# EAGLE design open-lux-I (EAGLE 6.5.0)
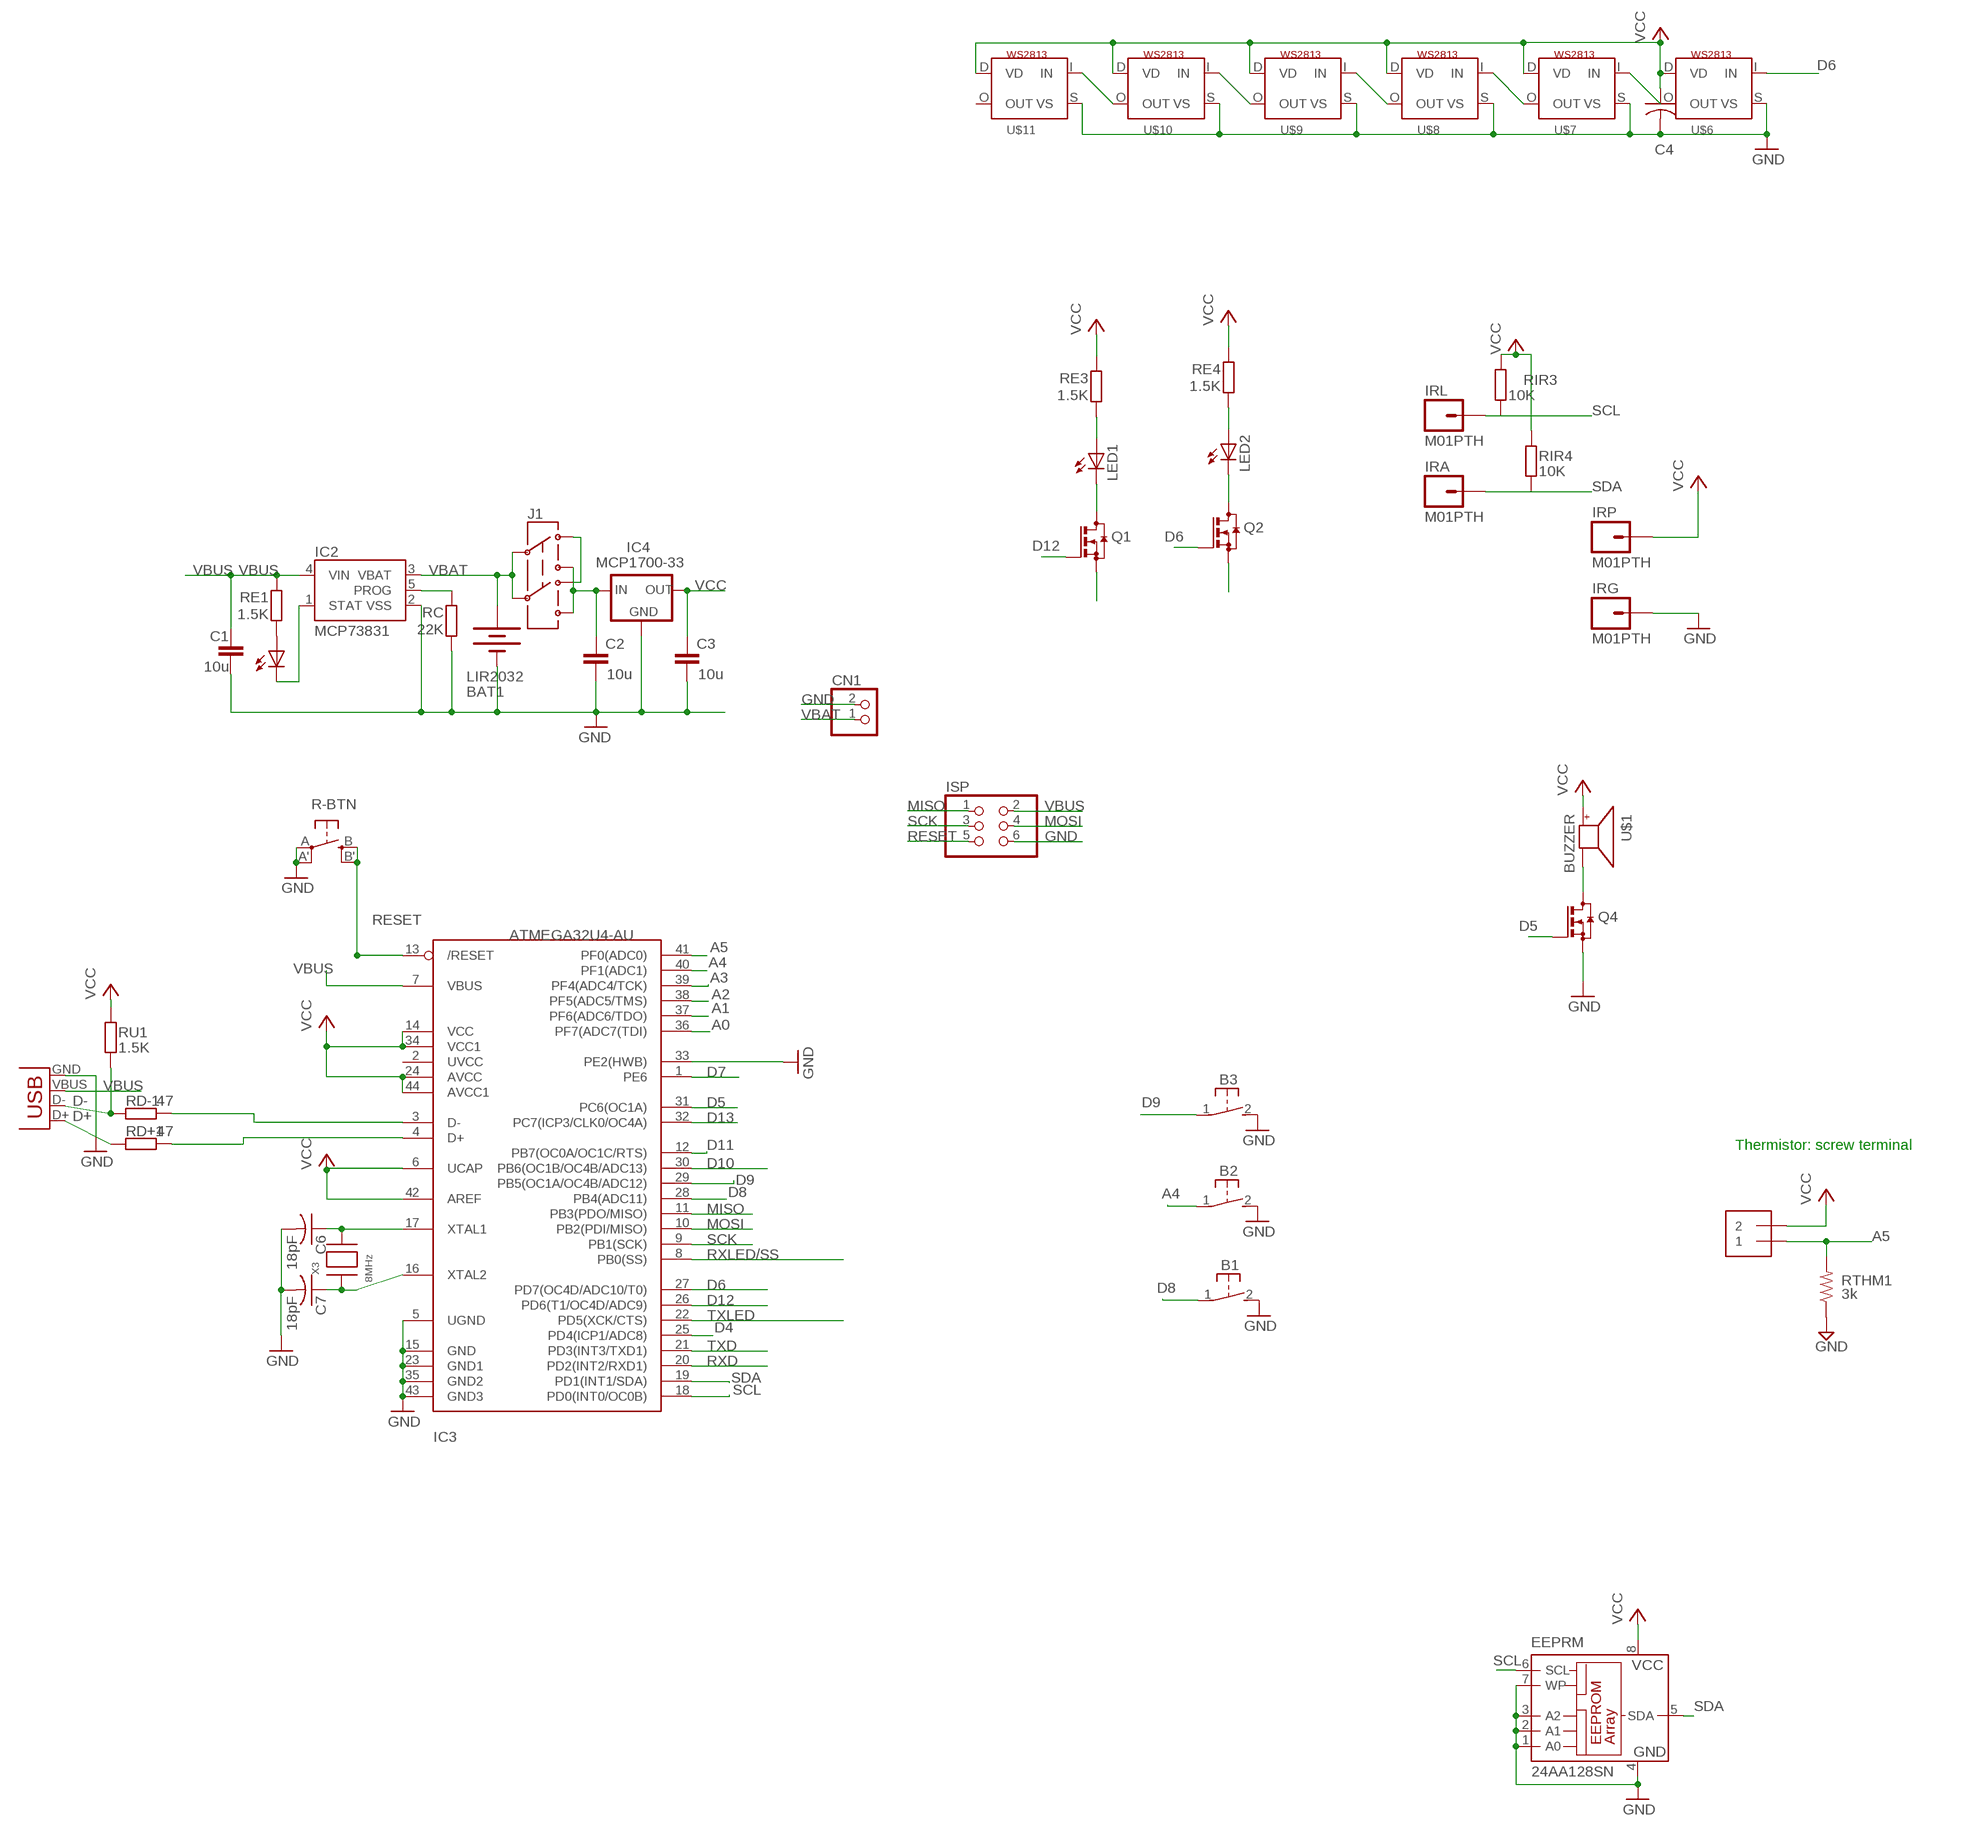
[diagram p0: schematic, sheet 1, part 1 of 2]
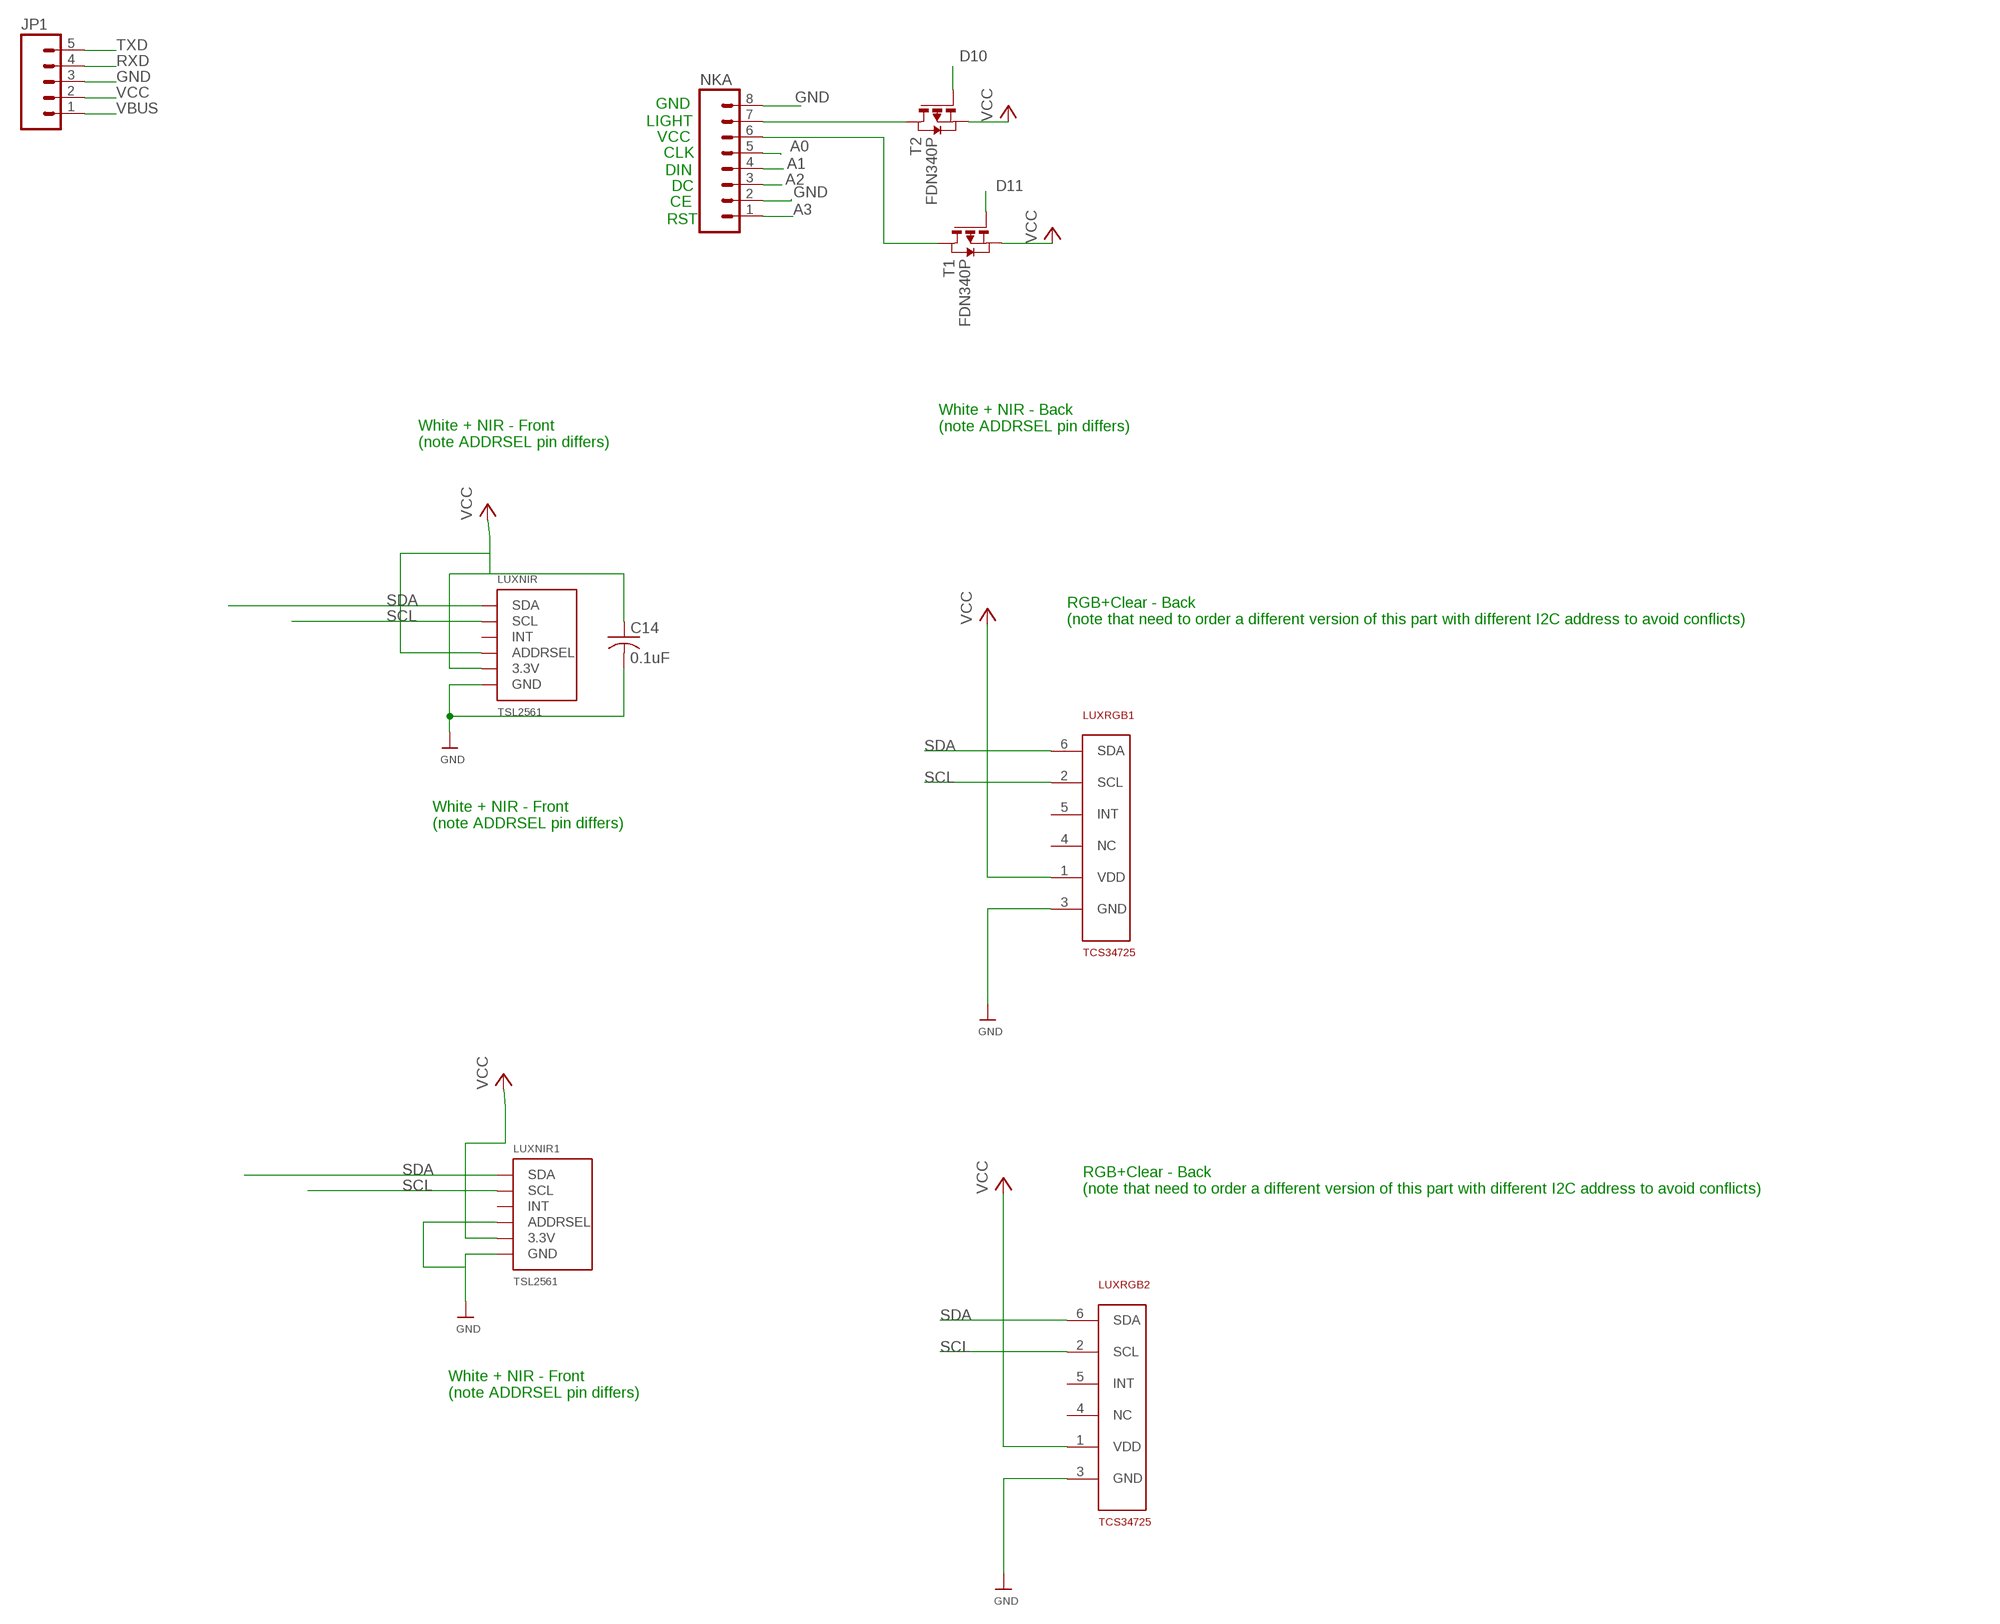
[diagram p1: schematic, sheet 1, part 2 of 2]

## Parts
B1  31-XX  [B3F-31XX]
B2  31-XX  [B3F-31XX]
B3  31-XX  [B3F-31XX]
BAT1  LIR2032  BATTERYBATTCOM_20MM_PTH_SMT  [BATTCOM_20MM_PTH_SMT]
C1  10u  C-EUC0805  [C0805]
C2  10u  C-EUC0805  [C0805]
C3  10u  C-EUC0805  [C0805]
C4  C-USC0805K  [C0805K]
C6  18pF  C-USC0805K  [C0805K]
C7  18pF  C-USC0805K  [C0805K]
C14  0.1uF  C-USC0805  [C0805]
CHARGE  0805  LEDCHIPLED_0805  [CHIPLED_0805]
CN1  JST_2PIN-SMT-RA  [JST-PH-2-SMT-RA]
EEPRM  24AA128SN  [SO-08]
IC2  MCP73831  [SOT23-5]
IC3  ATMEGA32U4-AU  [TQFP44]
IC4  MCP1700-33  MCP1700SOT233  [SOT23]
IRA  M01PTH  [1X01]
IRG  M01PTH  [1X01]
IRL  M01PTH  [1X01]
IRP  M01PTH  [1X01]
ISP  PINHD-2X3  [2X03]
J1  AYZ0202  [AYZ0202]
JP1  M05LOCK  [1X05_LOCK]
LED1  LEDCHIP-LED0603  [CHIP-LED0603]
LED2  LEDCHIP-LED0603  [CHIP-LED0603]
LUXNIR  TSL2561  [TSL2561_FN@1]
LUXNIR1  TSL2561  [TSL2561_FN@1]
LUXRGB1  TCS34725  [DFN-6]
LUXRGB2  TCS34725  [DFN-6]
NKA  M08LOCK  [1X08_LOCK]
Q1  BSS123  [SOT23]
Q2  BSS123  [SOT23]
Q4  BSS123  [SOT23]
R-BTN  EVQQ2  [EVQ-Q2]
RC  22K  R-EU_R0805  [R0805]
RD+1  47  R-EU_R0805  [R0805]
RD-1  47  R-EU_R0805  [R0805]
RE1  1.5K  R-EU_R0805  [R0805]
RE3  1.5K  R-EU_R0805  [R0805]
RE4  1.5K  R-EU_R0805  [R0805]
RIR3  10K  R-EU_R0805  [R0805]
RIR4  10K  R-EU_R0805  [R0805]
RTHM1  3k  R-US_R0805  [R0805@1]
RU1  1.5K  R-EU_R0805  [R0805]
T1  FDN340P  PMOSSOT23  [SOT-23]
T2  FDN340P  PMOSSOT23  [SOT-23]
THM1  1X2-3.5MM  [1X2-3.5MM]
U$1  BUZZER  [SMT-8585-BUZZER]
U$6  WS2813  [RGBLED5050_4]
U$7  WS2813  [RGBLED5050_4]
U$8  WS2813  [RGBLED5050_4]
U$9  WS2813  [RGBLED5050_4]
U$10  WS2813  [RGBLED5050_4]
U$11  WS2813  [RGBLED5050_4]
X2  USBSMD  [USB-MINIB]
X3  8MHz  XTALNX5032  [NX5032]

## Nets
A0: IC3.36(PF7(ADC7(TDI)) NKA.5
A1: IC3.37(PF6(ADC6/TDO)) NKA.4
A2: IC3.38(PF5(ADC5/TMS)) NKA.3
A3: IC3.39(PF4(ADC4/TCK)) NKA.1
A4: B2.1(P) IC3.40(PF1(ADC1))
A5: IC3.41(PF0(ADC0)) RTHM1.2 THM1.1
D4: IC3.25(PD4(ICP1/ADC8))
D5: IC3.31(PC6(OC1A)) Q4.1(G)
D6: IC3.27(PD7(OC4D/ADC10/T0)) Q2.1(G) U$6.I(IN)
D7: IC3.1(PE6)
D8: B1.1(P) IC3.28(PB4(ADC11))
D9: B3.1(P) IC3.29(PB5(OC1A/OC4B/ADC12))
D10: IC3.30(PB6(OC1B/OC4B/ADC13)) T2.3(G)
D11: IC3.12(PB7(OC0A/OC1C/RTS)) T1.3(G)
D12: IC3.26(PD6(T1/OC4D/ADC9)) Q1.1(G)
D13: IC3.32(PC7(ICP3/CLK0/OC4A))
D+: RD+1.1 X2.D+
D-: RD-1.1 RU1.1 X2.D-
GND: B1.2(S) B2.2(S) B3.2(S) BAT1.P$1(-) C1.2 C2.2 C3.2 C4.2 C6.2 C7.2 C14.2 CN1.2 EEPRM.1(A0) EEPRM.2(A1) EEPRM.3(A2) EEPRM.4(GND) EEPRM.7(WP) IC2.2(VSS) IC3.5(UGND) IC3.15(GND) IC3.23(GND1) IC3.33(PE2(HWB)) IC3.35(GND2) IC3.43(GND3) IC4.1(GND) IRG.1 ISP.6 JP1.3 LUXNIR1.ADR(ADDRSEL) LUXNIR1.VSS(GND) LUXNIR.VSS(GND) LUXRGB1.3(GND) LUXRGB2.3(GND) NKA.2 NKA.8 Q4.2(S) R-BTN.A'(P1) R-BTN.A(P) RC.1 RTHM1.1 U$6.S(VS) U$7.S(VS) U$8.S(VS) U$9.S(VS) U$10.S(VS) U$11.S(VS) X2.GND
GND1: Q1.2(S)
GND2: Q2.2(S)
MISO: IC3.11(PB3(PDO/MISO)) ISP.1
MOSI: IC3.10(PB2(PDI/MISO)) ISP.4
N$1: J1.3 J1.6
N$2: C7.1 IC3.16(XTAL2) X3.P$1
N$3: C6.1 IC3.17(XTAL1) X3.P$2
N$4: NKA.7 T2.1(D)
N$5: CHARGE.C IC2.1(STAT)
N$6: IC2.5(PROG) RC.2
N$7: Q4.3(D) U$1.-
N$8: NKA.6 T1.1(D)
N$9: LED1.C Q1.3(D)
N$10: CHARGE.A RE1.1
N$11: LED1.A RE3.1
N$12: LED2.C Q2.3(D)
N$13: LED2.A RE4.1
N$21: IC3.4(D+) RD+1.2
N$22: IC3.3(D-) RD-1.2
N$23: U$6.O(OUT) U$7.I(IN)
N$24: U$7.O(OUT) U$8.I(IN)
N$25: U$8.O(OUT) U$9.I(IN)
N$26: U$9.O(OUT) U$10.I(IN)
N$28: U$10.O(OUT) U$11.I(IN)
RESET: IC3.13(/RESET) ISP.5 R-BTN.B'(S1) R-BTN.B(S)
RXD: IC3.20(PD2(INT2/RXD1)) JP1.4
RXLED/SS: IC3.8(PB0(SS))
SCK: IC3.9(PB1(SCK)) ISP.3
SCL: EEPRM.6(SCL) IC3.18(PD0(INT0/OC0B)) IRL.1 LUXNIR1.CLK(SCL) LUXNIR.CLK(SCL) LUXRGB1.2(SCL) LUXRGB2.2(SCL) RIR3.1
SDA: EEPRM.5(SDA) IC3.19(PD1(INT1/SDA)) IRA.1 LUXNIR1.DATA(SDA) LUXNIR.DATA(SDA) LUXRGB1.6(SDA) LUXRGB2.6(SDA) RIR4.1
TXD: IC3.21(PD3(INT3/TXD1)) JP1.5
TXLED: IC3.22(PD5(XCK/CTS))
VBAT: BAT1.P$2(+) CN1.1 IC2.3(VBAT) J1.2 J1.5
VBUS: C1.1 IC2.4(VIN) IC3.7(VBUS) ISP.2 JP1.1 RE1.2 X2.VBUS
VCC: C3.1 C4.1 C14.1 EEPRM.8(VCC) IC3.6(UCAP) IC3.14(VCC) IC3.24(AVCC) IC3.34(VCC1) IC3.42(AREF) IC3.44(AVCC1) IC4.2(OUT) IRP.1 JP1.2 LUXNIR1.VDD(3.3V) LUXNIR.ADR(ADDRSEL) LUXNIR.VDD(3.3V) LUXRGB1.1(VDD) LUXRGB2.1(VDD) RE3.2 RE4.2 RIR3.2 RIR4.2 RU1.2 T1.2(S) T2.2(S) THM1.2 U$1.+ U$6.D(VD) U$7.D(VD) U$8.D(VD) U$9.D(VD) U$10.D(VD) U$11.D(VD)
VDD: C2.1 IC4.3(IN) J1.1 J1.4
Unconnected: IC3.2(UVCC) LUXNIR1.INT LUXNIR.INT LUXRGB1.4(NC) LUXRGB1.5(INT) LUXRGB2.4(NC) LUXRGB2.5(INT) U$11.O(OUT)

## Notes on the sheet
- GND
- LIGHT
- VCC
- CLK
- DIN
- DC
- CE
- RST
- White + NIR - Back
  (note ADDRSEL pin differs)
- White + NIR - Front
  (note ADDRSEL pin differs)
- RGB+Clear - Back 
  (note that need to order a different version of this part with different I2C address to avoid conflicts)
- White + NIR - Front
  (note ADDRSEL pin differs)
- Thermistor: screw terminal
- RGB+Clear - Back 
  (note that need to order a different version of this part with different I2C address to avoid conflicts)
- White + NIR - Front
  (note ADDRSEL pin differs)

## Library data of the parts
B1-B3 = adafruit:31-XX: OMRON SWITCH Now with beefier pads!
BAT1 = SparkFunNew:BATTERY: Battery Holders Various common sizes : AA, AAA, 20mm coin cell and 12mm coin cell.
C1-C3 = resistor:C-EU: CAPACITOR, European symbol
C4 = adafruit2013:C-US: CAPACITOR, American symbol
C6 C7 C14 = adafruit:C-US: CAPACITOR, American symbol
CHARGE = led:LED: LED
CN1 = adafruit:JST_2PIN: JST 2-Pin Connectors of various flavors SMT-RA (S2B-PH-SM4) 4UConnector #17311 SMT (B2B-PH-SM4) THM-RA (S2B-PH) THM (B2B-PH)
EEPRM = microchip:24*: Serial EEPROM I2C; MF: MICROCHIP; MPN: 24AA128-I/SN; OC_FARNELL: unknown; OC_NEWARK: 92C6842
IC2 = SparkFunNew:MCP73831: Microchip's MCP73831 Miniature single cell, fully integrated Li-Ion, Li-polymer charge management controller http://ww1.microchip.com/downloads/en/DeviceDoc/21984a.pdf
IC3 = adaprog:ATMEGA32U4
IC4 = adafruit:MCP1700: VOLTAGE REGULATOR
IRA IRG IRL IRP = SparkFun-Connectors:M01: Header 1 Standard 1-pin 0.1" header. Use with straight break away headers (SKU : PRT-00116), right angle break away headers (PRT-00553), swiss pins (PRT-00743), machine pins (PRT-00117), and female headers (PRT-00115).
ISP = pinhead:PINHD-2X3: PIN HEADER
J1 = SparkFunNew:AYZ0202: SPDT Slide Switch Simple SMD single-pull double-throw slide switch. Good for less than 350mA power switch, switching UARTs between devices, etc. Spark Fun Electronics SKU : COM-00597
JP1 = SparkFun-Connectors:M05: Header 5 Standard 5-pin 0.1" header. Use with straight break away headers (SKU : PRT-00116), right angle break away headers (PRT-00553), swiss pins (PRT-00743), machine pins (PRT-00117), and female headers (PRT-00115). Molex polarized connector foot print use with SKU : PRT-08230 with associated crimp pins and housings.
LED1 LED2 = adafruit:LED: LED
LUXNIR LUXNIR1 = microbuilder:TSL2561: TSL2561 Light-To-Digital Sensor Mouser Part Numbers: CS (obsolete): 856-TSL2561CS DFN (cheapest): 856-TSL2561FN
LUXRGB1 LUXRGB2 = dwbLibrary:TCS34725
NKA = SparkFun-Connectors:M08: Header 8 Standard 8-pin 0.1" header. Use with straight break away headers (SKU : PRT-00116), right angle break away headers (PRT-00553), swiss pins (PRT-00743), machine pins (PRT-00117), and female headers (PRT-00115).
Q1 Q2 Q4 = transistor-small-signal:BSS123: N-CHANNEL MOS FET
R-BTN = adafruit:EVQQ2: SMT 6mm switch, EVQQ2 series http://www.ladyada.net/library/eagle
RC RD+1 RD-1 RE1 RE3 RE4 RIR3 RIR4 RU1 = rcl:R-EU_: RESISTOR, European symbol
RTHM1 = rcl:R-US_: RESISTOR, American symbol
T1 T2 = zetex:PMOSSOT23: MOS FET
THM1 = adafruit:1X2: 3.5mm Terminal block http://www.ladyada.net/library/pcb/eaglelibrary.html
U$1 = adafruit:BUZZER
U$6-U$11 = adafruit:WS2813
X2 = SparkFun:USB: USB Connectors USB-B-PTH is fully proven SKU : PRT-00139 USB-miniB is fully proven SKU : PRT-00587 USB-A-PCB is untested. USB-A-H is throughly reviewed, but untested. Spark Fun Electronics SKU : PRT-00437 USB-B-SMT is throughly reviewed, but untested. Needs silkscreen touching up. USB-A-S has not been used/tested USB-MB-H has not been used/tested
X3 = adaprog:XTAL

## Net classes
0 default: width 0.254 mm, clearance 0.254 mm
1 power: width 0.254 mm, clearance 0.203 mm

## Board
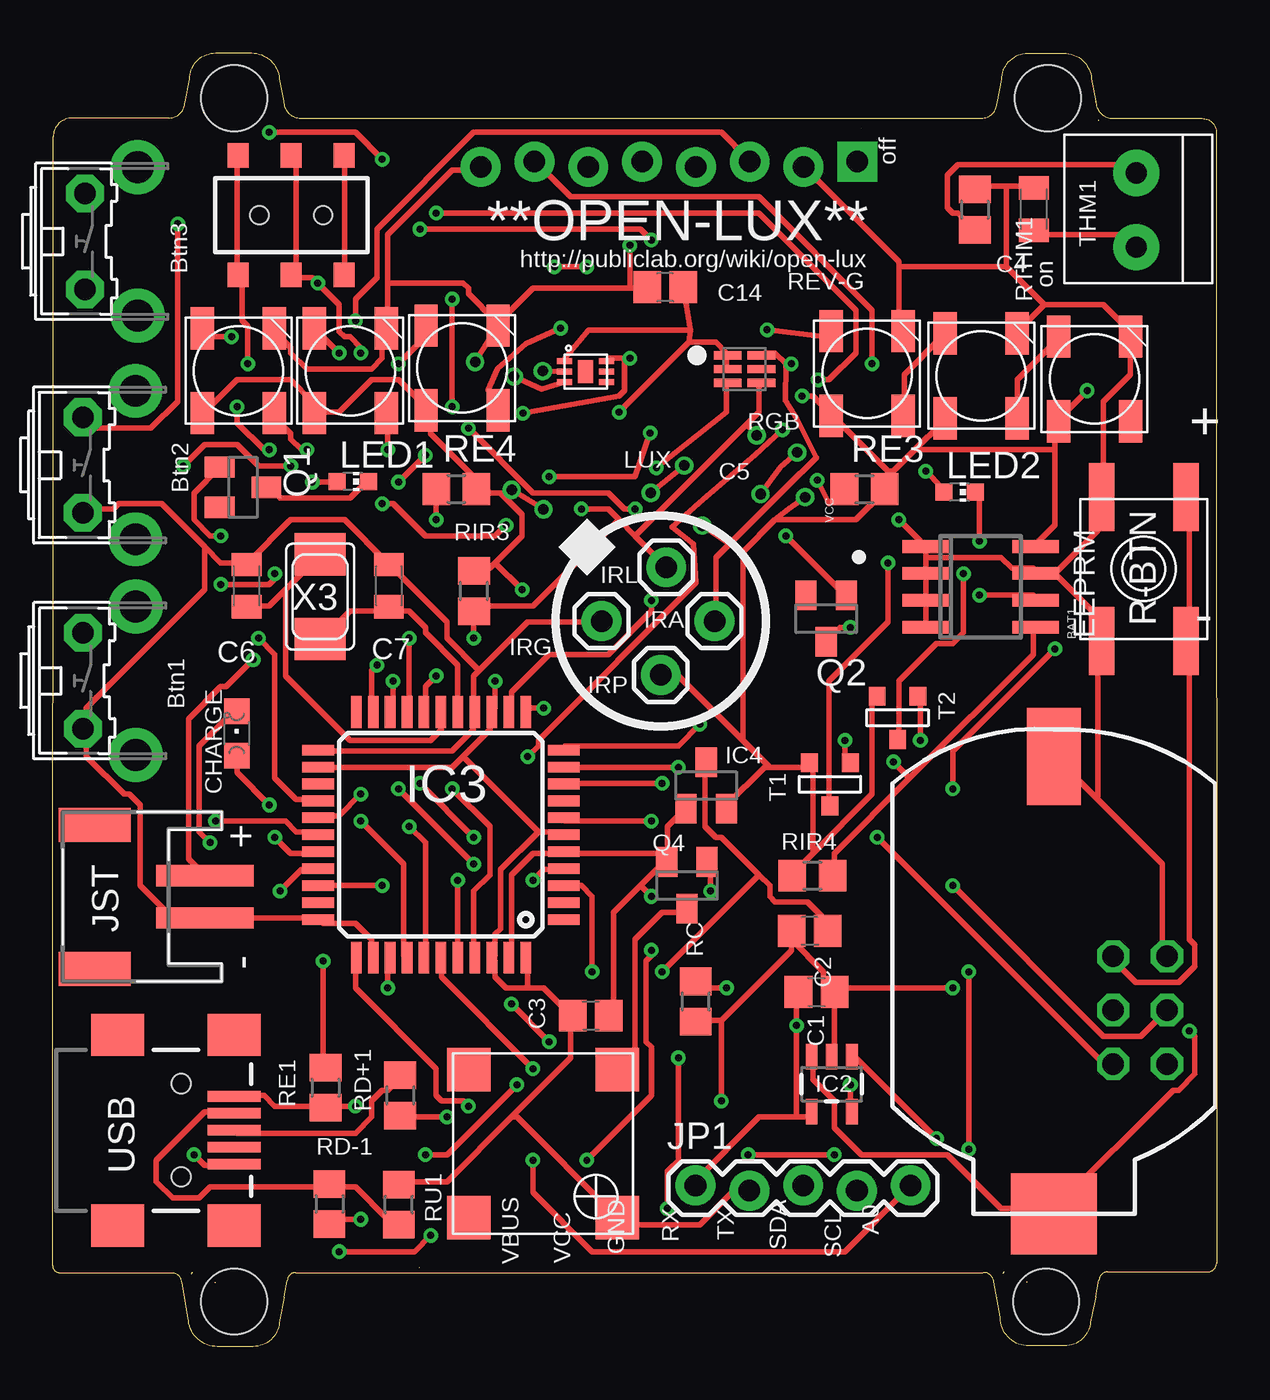
[diagram p2: board, top side]
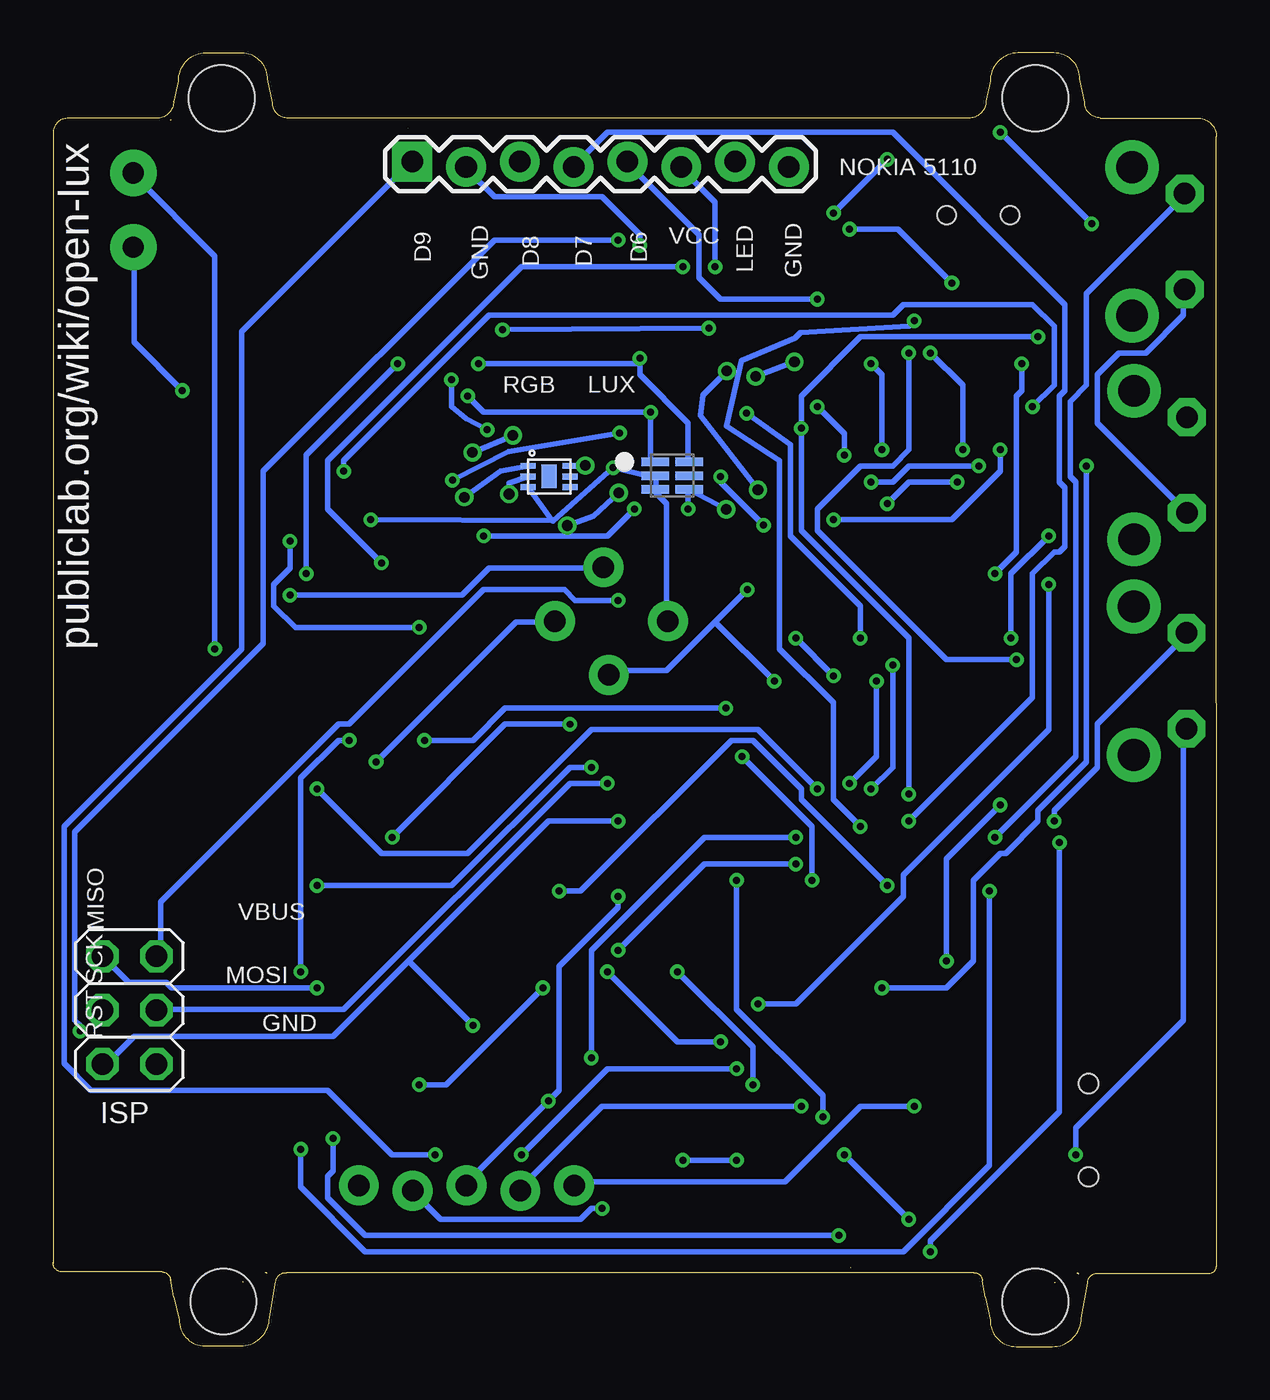
[diagram p3: board, bottom side, seen from below]

Size 54.93 x 61.06 mm. Coordinates in mm from the lower left corner, seen from the top.
Outline: 54.92,57.31 54.93,3.93
Outline: 7.63,3.03 arc-90 7.65,3.01
Outline: 17.28,3.73 arc-90 17.29,3.72
Outline: 38.17,57.5 arc-90 38.16,57.51
Outline: 49.35,57.89 arc90 49.37,57.91
Outline: 43.89,3.49 11.45,3.49 arc90 11.06,3.1
Outline: 43.84,57.98 11.7,57.98 arc-90 10.89,58.79 10.89,58.78 10.69,59.73 arc90 9.38,61.06 7.68,61.06 arc90 6.45,59.82 6.23,58.73 arc-90 5.49,57.99 0.9,57.99 arc90 0.01,57.1 0.01,56.91 0,3.82 arc90 0.36,3.46 5.59,3.46 arc-90 6.09,3.02 6.39,1.34 arc90 7.76,0 9.46,0 arc90 10.69,1.24 10.91,2.33 11.06,3.11
Outline: 43.83,57.98 arc90 44.57,58.72 44.79,59.81 arc-90 46.02,61.05 47.72,61.05 arc-90 49.03,59.72 49.23,58.77 49.23,58.78 arc90 50.04,57.97 54.26,57.97 arc-90 54.92,57.31
Outline: 6.25,2.28 6.25,2.27
Outline: 6.59,3.48 arc90 6.53,3.42
Outline: 45.95,3.06 arc-90 45.97,3.04
Outline: 44.57,2.31 44.57,2.3
Outline: 49.38,3.14 49.23,2.36 48.98,1.27 arc-90 47.75,0.03 46.08,0.03 arc-90 44.71,1.37 44.41,3.05 arc90 43.91,3.49
Outline: 49.38,3.13 arc-90 49.77,3.52 54.49,3.52 arc90 54.93,3.96
Outline: 44.91,3.51 arc90 44.85,3.45
Copper layers (1*16): Top 0.0356mm / dielectric 1.5011mm / Bottom 0.0356mm
Design rules "LaenPCBOrder": minimum track width 6mil, minimum drill 13mil, track to track 6mil, track to pad 6mil, pad to pad 6mil, via to via 6mil, smd to smd 6mil, copper to edge 15mil, drill to drill 6mil, minimum pad ring 7mil, minimum via ring 7mil, stop-mask expansion 3mil, vias tented up to drill 0mil, thermal gap 10mil
Holes 3.1 mm at 8.56,58.92 46.96,58.92 8.56,2.12 46.88,2.12

### Footprints (pad centres in the part's own frame; a part is rotated, then mirrored left to right if it is on the bottom)
B3F-31XX = drill 1.016 pad 1.778 octagon: 1 -2.261,-1.245; 2 2.261,-1.245 | drill 1.499 pad 2.54: 3 -3.505,1.245; 4 3.505,1.245
BATTCOM_20MM_PTH_SMT = smd 4.572 x 2.54: P$1 0,0 | smd 3.81 x 4.064: P$2 21.59,0
C0805 = smd 1.3 x 1.5: 1 -0.85,0; 2 0.85,0
C0805K = smd 1.1 x 1.4: 1 -1,0; 2 1,0
CHIPLED_0805 = smd 1.2 x 1.2: A 0,-1.05; C 0,1.05
JST-PH-2-SMT-RA = smd 1 x 4.6: 1 1,-3.7; 2 -1,-3.7 | smd 1.6 x 3.4: NC1 -3.4,1.5; NC2 3.4,1.5
SO-08 = smd 0.6 x 2.2: 1 -1.905,-2.6; 2 -0.635,-2.6; 3 0.635,-2.6; 4 1.905,-2.6; 5 1.905,2.6; 6 0.635,2.6; 7 -0.635,2.6; 8 -1.905,2.6
SOT23-5 = smd 0.55 x 1.2: 1 -0.95,-1.3; 2 0,-1.3; 3 0.95,-1.3; 4 0.95,1.3; 5 -0.95,1.3
TQFP44 = smd 1.5 x 0.5: 1 -5.8,4; 2 -5.8,3.2; 3 -5.8,2.4; 4 -5.8,1.6; 5 -5.8,0.8; 6 -5.8,0; 7 -5.8,-0.8; 8 -5.8,-1.6; 9 -5.8,-2.4; 10 -5.8,-3.2; 11 -5.8,-4; 23 5.8,-4; 24 5.8,-3.2; 25 5.8,-2.4; 26 5.8,-1.6; 27 5.8,-0.8; 28 5.8,0; 29 5.8,0.8; 30 5.8,1.6; 31 5.8,2.4; 32 5.8,3.2; 33 5.8,4 | smd 0.5 x 1.5: 12 -4,-5.8; 13 -3.2,-5.8; 14 -2.4,-5.8; 15 -1.6,-5.8; 16 -0.8,-5.8; 17 0,-5.8; 18 0.8,-5.8; 19 1.6,-5.8; 20 2.4,-5.8; 21 3.2,-5.8; 22 4,-5.8; 34 4,5.8; 35 3.2,5.8; 36 2.4,5.8; 37 1.6,5.8; 38 0.8,5.8; 39 0,5.8; 40 -0.8,5.8; 41 -1.6,5.8; 42 -2.4,5.8; 43 -3.2,5.8; 44 -4,5.8
SOT23 = smd 1 x 1.4: 1 -0.95,-1.1; 2 0.95,-1.1; 3 0,1.1
1X01 = drill 1.016 pad 1.88: 1 0,0
2X03 = drill 1.016 octagon: 1 -2.54,-1.27; 2 -2.54,1.27; 3 0,-1.27; 4 0,1.27; 5 2.54,-1.27; 6 2.54,1.27
AYZ0202 = smd 1 x 1.15: 1 -2.5,2.825; 2 0,2.825; 3 2.5,2.825; 4 -2.5,-2.825; 5 0,-2.825; 6 2.5,-2.825 | hole 0.85: 1.5,0; -1.5,0
1X05_LOCK = drill 1.016 pad 1.88: 1 0,0.127; 2 2.54,-0.127; 3 5.08,0.127; 4 7.62,-0.127; 5 10.16,0.127
CHIP-LED0603 = smd 0.8 x 0.8: A 0,-0.75; C 0,0.75
TSL2561_FN@1 = smd 1.3 x 0.4: ADR -0.8,0; CLK 0.8,-0.65; DATA 0.8,0.65; INT 0.8,0; VDD -0.8,0.65; VSS -0.8,-0.65
DFN-6 = smd 0.28 x 0.7: 1 -0.5,-0.988; 2 0,-0.988; 3 0.5,-0.988; 4 0.5,0.988; 5 0,0.988; 6 -0.5,0.988 | smd 1.1 x 0.7: P$1 0,0
1X08_LOCK = drill 1.016 pad 1.88 square: 1 0,0.127 | drill 1.016 pad 1.88: 2 2.54,-0.127; 3 5.08,0.127; 4 7.62,-0.127; 5 10.16,0.127; 6 12.7,-0.127; 7 15.24,0.127; 8 17.78,-0.127
EVQ-Q2 = smd 3.2 x 1.2: A -3.4,-2; A' 3.4,-2; B -3.4,2; B' 3.4,2
R0805 = smd 1.3 x 1.5: 1 -0.95,0; 2 0.95,0
R0805@1 = smd 1.3 x 1.5: 1 -0.95,0; 2 0.95,0
SOT-23 = smd 0.787 x 0.889: 1 0.025,-1.016; 2 -0.94,1.016; 3 0.991,1.016
1X2-3.5MM = drill 1 pad 2.184: 1 1.8,0; 2 -1.7,0
SMT-8585-BUZZER = smd 2.05 x 2.05: + -3.5,-3.5; - 3.5,-3.5; NC1 -3.5,3.5; NC2 3.5,3.5
RGBLED5050_4 = smd 2 x 1.1: D -2,1.7; I 2,1.7; O -2,-1.7; S 2,-1.7
USB-MINIB = smd 2.5 x 0.5: D+ 2.5,0; D- 2.5,0.8; GND 2.5,-1.6; ID 2.5,-0.8; VBUS 2.5,1.6 | smd 2.5 x 2: GND@1 -3,-4.5; GND@2 -3,4.5; GND@3 2.5,4.5; GND@4 2.5,-4.5 | hole 0.9: 0,2.2; 0,-2.2
NX5032 = smd 2 x 2.4: P$1 2,0; P$2 -2,0

### Placement (x,y rotation side)
B1  2.66,31.43 270 top
B2  2.65,41.61 270 top
B3  2.75,52.17 270 top
BAT1  47.25,27.85 270 top
C1  36.04,16.74 0 top
C2  35.73,19.62 180 top
C3  25.38,15.62 0 top
C4  46.3,53.68 90 top
C6  9.14,35.91 90 top
C7  15.86,35.91 90 top
C14  28.9,50 180 top
CHARGE  8.68,28.94 0 top
CN1  3.47,21.22 90 top
EEPRM  43.79,35.86 270 top
IC2  36.76,12.38 180 top
IC3  18.32,24.15 180 top
IC4  30.84,26.48 0 top
IRA  31.23,34.24 0 top
IRG  25.9,34.24 0 top
IRL  28.95,36.78 0 top
IRP  28.69,31.7 0 top
ISP  51.32,15.88 90 bottom
J1  11.25,53.4 0 top
JP1  30.33,7.48 0 top
LED1  14.16,40.83 270 top
LED2  42.8,40.33 270 top
LUXNIR  32.64,46.14 0 top
LUXNIR1  25.7,41.11 0 bottom
LUXRGB1  25.14,46.02 270 top
LUXRGB2  31.51,41.07 270 bottom
NKA  37.97,55.81 0 bottom
Q1  8.97,40.56 270 top
Q2  36.5,34.36 180 top
Q4  29.93,21.77 180 top
R-BTN  51.49,36.7 270 top
RC  30.34,16.29 90 top
RD+1  16.39,11.85 270 top
RD-1  13.05,6.72 270 top
RE1  12.87,12.22 270 top
RE3  38.31,40.47 0 top
RE4  19.04,40.48 0 top
RIR3  19.88,35.66 90 top
RIR4  35.85,22.22 180 top
RTHM1  43.52,53.66 270 top
RU1  16.32,6.7 90 top
T1  36.65,26.54 0 top
T2  39.84,29.68 0 top
THM1  51.14,53.6 90 top
U$1  23.14,9.58 90 top
U$6  8.76,46.06 90 top
U$7  14.03,46.06 90 top
U$8  19.31,46.19 90 top
U$9  38.43,45.93 90 top
U$10  43.82,45.82 90 top
U$11  49.16,45.67 90 top
X2  6.05,10.21 0 top
X3  12.61,35.39 270 top

### Tracks (layer width: path | path; a pad name or v marks a point on that pad's centre or on a via)
A0  (via drill 0.33)
  Top 0.254: v15.8,16.93 15.8,18.2 IC3.36 | v6.15,41.57 7.16,42.58 8.69,42.58 9.7,41.57 v11.23,41.57 | v17.58,42.07 v16.31,40.8 | v18.85,49.44 v18.85,44.36
  Bottom 0.254: v15.8,16.93 12.75,16.93 11.48,18.2 11.48,22.01 10.21,23.28 9.96,23.28 8.43,24.8 8.43,25.31 6.15,27.6 v6.15,41.57 | v11.23,41.57 14.53,41.57 15.29,40.8 v16.31,40.8 | v17.58,42.07 17.58,43.09 v18.85,44.36 | v18.85,49.44 23.42,49.44 24.44,50.46 24.44,52.49 27.74,55.79 NKA.5
A1  (via drill 0.33)
  Top 0.254: v14.53,24.8 16.56,22.77 16.56,18.45 IC3.37
  Bottom 0.254: v14.53,24.8 8.69,30.64 8.69,36.49 7.67,37.5 7.42,37.5 7.16,37.76 7.16,40.55 7.42,40.8 7.42,44.87 7.16,45.12 7.16,49.19 15.29,57.31 28.75,57.31 30.28,55.79 NKA.4
A2  (via drill 0.33)
  Top 0.254: v16.82,24.55 17.58,23.79 17.58,18.45 IC3.38 | v14.28,48.42 14.28,49.44 15.29,50.46 15.29,52.74 19.86,57.31 31.55,57.31 32.82,56.04 NKA.3
  Bottom 0.254: v16.82,24.55 18.09,25.82 18.09,30.39 20.63,32.93 20.63,41.82 23.14,43.44 22.42,46.54 19.9,47.61 19.64,47.86 14.53,48.17 v14.28,48.42
A3  (via drill 0.33)
  Top 0.254: v22.66,13.12 18.34,17.44 18.34,18.2 IC3.39 | v36.88,9.05 v32.82,9.05
  Bottom 0.254: v22.66,13.12 28.75,13.12 v32.82,9.05 | v36.88,9.05 38.91,9.05 41.96,12.1 53.14,12.1 54.41,13.37 54.41,24.55 46.03,32.93 46.03,47.92 38.15,55.79 NKA.1
A4  (via drill 0.33)
  Top 0.254: v19.1,22.01 19.1,18.45 IC3.40 | v22.4,27.85 22.91,28.36 22.91,28.61 30.36,36.06 30.24,37.88 29.23,38.69 30.72,40 33.13,42.09 v34.43,43.28 | v36.12,45.63 36.63,45.63 37.9,46.9 37.9,48.93 33.33,53.5 v18.09,53.5 | v15.55,56.04 14.28,57.31 v10.21,57.31 | v5.89,53 5.89,44.61 4.62,43.34 2.08,43.34 1.58,43.85 B2.1
  Bottom 0.254: v19.1,22.01 19.1,24.55 v22.4,27.85 | v34.43,43.28 35.42,43.79 36.12,44.36 v36.12,45.63 | v15.55,56.04 v18.09,53.5 | v5.89,53 v10.21,57.31
A5  (via drill 0.33)
  Top 0.254: v18.85,26.33 20.63,24.55 20.63,22.26 19.86,21.5 19.86,18.45 IC3.41 | v42.47,26.33 42.47,28.1 v47.3,32.93 | RTHM1.2 42.72,53.5 42.47,53.5 42.22,53.76 42.22,55.28 42.72,55.79 50.85,55.79 51.11,55.54 THM1.1
  Bottom 0.254: v18.85,26.33 21.64,29.12 29.52,29.12 35.36,23.28 39.42,23.28 v42.47,26.33 | v47.3,32.93 47.3,51.47 51.11,55.28 THM1.1
D5  (via drill 0.33)
  Top 0.254: v31.04,21.5 31.04,22.77 Q4.1 | IC3.31 v15.55,21.75
  Bottom 0.254: v31.04,21.5 30.02,21.5 22.91,28.61 21.9,28.61 19.61,26.33 19.61,25.82 v15.55,21.75
D6  (via drill 0.33)
  Top 0.254: v34.6,38.26 37.39,35.47 Q2.1 | v27.48,39.53 26.98,39.53 26.21,40.3 22.66,40.3 v19.61,43.34 | v8.43,47.66 7.42,47.66 7.16,47.92 U$6.I | v14.53,26.07 13.51,25.06 12.75,25.06 IC3.27
  Bottom 0.254: v34.6,38.26 28.75,38.26 v27.48,39.53 | v8.43,47.66 16.82,47.66 19.61,44.87 v19.61,43.34 19.61,38.52 14.53,33.44 v14.53,26.07
D8  (via drill 0.33)
  Top 0.254: v7.67,24.8 10.97,24.8 11.48,24.29 12.5,24.29 IC3.28
  Bottom 0.254: v7.67,24.8 7.67,25.31 5.64,27.34 5.64,29.37 1.58,33.44 B1.1
D9  (via drill 0.33)
  Top 0.254: v10.47,24.04 11.23,23.28 12.5,23.28 IC3.29
  Bottom 0.254: v10.47,24.04 6.66,27.85 6.66,40.8 6.91,41.06 6.91,44.61 6.15,45.38 6.15,49.69 1.58,54.27 B3.1
D10  (via drill 0.33)
  Top 0.254: v40.95,28.61 40.95,30.64 T2.3 | v43.23,9.31 v43.23,17.69 | v10.72,21.5 11.74,22.52 12.5,22.52 IC3.30
  Bottom 0.254: v40.95,28.61 41.45,28.61 43.23,26.83 v43.23,17.69 | v43.23,9.31 43.23,7.53 40.18,4.48 14.78,4.48 10.72,8.55 v10.72,21.5
D11  (via drill 0.33)
  Top 0.254: v37.39,28.61 37.39,27.6 T1.3 | v23.17,30.14 22.4,30.14 IC3.12
  Bottom 0.254: v37.39,28.61 35.1,28.61 33.58,30.14 v23.17,30.14
D12  (via drill 0.33)
  Top 0.254: Q1.1 6.66,40.3 6.66,39.03 7.42,38.26 v7.93,38.26 | v9.7,33.44 10.47,32.68 10.47,26.83 11.48,25.82 12.5,25.82 IC3.26
  Bottom 0.254: v7.93,38.26 9.7,36.49 v9.7,33.44
D+
  Top 0.254: RD+1.1 16.31,12.61 15.8,12.1 15.55,12.1 15.04,11.59 15.04,10.83 14.28,10.07 8.69,10.07 X2.D+
D-
  Top 0.254: RU1.1 16.31,6.01 15.8,6.01 14.28,7.53 13.26,7.53 RD-1.1 13.01,7.53 7.42,7.53 6.91,7.02 5.64,7.02 4.88,7.78 4.88,8.8 7.16,11.09 8.43,11.09 X2.D-
GND  (via drill 0.33, 0.5 pad 0.25)
  Top 0.254: IC3.35 15.04,18.45 15.04,19.21 14.28,19.98 12.75,19.98 IC3.33 12.5,20.23 7.42,20.23 CN1.2 5.64,20.23 4.12,21.75 4.12,25.56 3.61,26.07 3.35,26.07 1.58,27.85 1.58,29.12 B1.2 1.58,29.37 1.58,30.14 7.16,35.72 7.16,37.76 | v6.66,9.05 7.16,8.55 8.43,8.55 X2.GND | 7.16,37.76 7.93,36.99 8.94,36.99 C6.2 9.2,36.99 11.23,39.03 13.77,39.03 15.8,36.99 C7.2 16.05,36.74 18.59,34.2 18.59,33.44 20.12,31.91 | 7.16,37.76 5.13,39.79 3.1,39.79 2.85,39.53 1.58,39.53 B2.2 | IC3.23 12.75,28.1 18.85,28.1 19.86,29.12 19.86,29.88 IC3.15 19.86,30.14 19.86,31.66 20.12,31.91 | v28.48,41.48 31.8,44.11 31.8,45.38 LUXNIR.VSS | 20.12,31.91 22.4,34.2 25.71,34.2 IRG.1 | IC3.43 21.64,18.45 21.64,22.26 22.66,23.28 23.93,23.28 IC3.5 24.18,23.28 29.01,23.28 | 29.01,23.28 29.01,24.55 29.77,25.31 IC4.1 | 29.01,23.28 29.01,23.02 Q4.2 | 27.74,21.75 28.75,22.77 Q4.2 | 27.74,21.75 26.47,20.48 26.47,15.66 C3.2 | 29.01,23.28 Q4.2 | IC2.2 36.88,13.88 36.88,16.67 C1.2 | 31.55,15.4 30.53,15.4 RC.1 | 31.55,15.4 34.85,18.71 34.85,19.21 | 34.85,19.21 34.85,19.47 C2.2 34.85,19.21 | 34.85,19.21 36.37,17.69 36.37,17.44 36.88,16.93 C1.2 | 31.55,15.4 v31.55,11.59 | v28.25,21.25 27.74,21.75 | EEPRM.4 41.2,34.2 EEPRM.3 41.2,35.47 EEPRM.2 41.2,36.74 41.2,37.25 | 41.2,37.25 41.2,37.76 EEPRM.1 40.95,38.01 v39.93,39.03 | 47.3,36.49 46.53,36.49 EEPRM.7 | 47.3,36.49 49.33,34.45 49.33,33.44 R-BTN.A' 49.33,33.18 49.33,25.82 | 41.2,37.25 44.76,37.25 45.26,36.74 46.28,36.74 EEPRM.7 | 49.33,25.82 47.3,27.85 BAT1.P$1 | 49.33,25.82 52.38,22.77 52.38,18.45 ISP.6 | 27.23,49.95 22.66,49.95 21.13,48.42 U$8.S | 27.23,49.95 27.99,49.95 C14.2
  Top 0.254: U$6.S 10.47,47.92 11.23,47.15 11.23,46.9 11.99,46.14 15.04,46.14 15.55,46.65 15.55,47.92 U$7.S 15.8,48.17 15.8,50.2 | 15.8,50.2 15.8,52.49 18.85,55.54 20.12,55.54 NKA.8 | 15.8,50.2 19.36,50.2 19.61,49.95 19.61,49.69 20.88,48.42 U$8.S | 39.93,50.96 39.93,51.22 35.61,55.54 NKA.2 | 39.93,50.96 39.93,48.17 U$9.S | 45.01,54.77 43.74,54.77 RTHM1.1 | 45.01,54.77 46.28,54.77 C4.2 | 46.79,49.19 45.52,47.92 U$10.S | 46.79,49.19 49.58,49.19 50.85,47.92 U$11.S 50.85,45.88 49.58,44.61 49.58,40.3 R-BTN.A 49.33,40.04 49.33,38.52 47.3,36.49 | 45.01,50.96 45.01,54.77 | 46.79,49.19 45.01,50.96 | 45.01,50.96 39.93,50.96 | v27.23,51.98 27.23,49.95 | 47.3,36.49 EEPRM.7 | v42.47,16.93 37.14,16.93 C1.2 | LUXRGB1.3 23.06,45.19 v21.76,45.79 | v19.93,46.48 U$8.S
  Bottom 0.254: v6.66,9.05 6.66,10.32 1.58,15.4 1.58,29.12 B1.2 | B3.2 1.58,49.69 1.58,48.68 3.35,46.9 4.62,46.9 5.64,45.88 5.64,43.6 1.58,39.53 B2.2 | IRG.1 25.96,34.45 25.96,39.79 26.47,40.3 LUXNIR1.VSS 26.47,40.55 26.47,41.06 LUXNIR1.ADR 26.72,41.06 v28.48,41.48 31.32,38.98 31.38,38.98 | JP1.3 35.36,7.78 v31.55,11.59 31.04,12.1 31.04,17.94 28.25,20.74 v28.25,21.25 | v27.23,51.98 27.23,52.49 29.01,54.27 34.09,54.27 35.36,55.54 NKA.2 | v42.47,16.93 49.33,16.93 49.58,17.18 51.36,17.18 52.38,18.2 ISP.6 | v39.93,39.03 31.38,38.98 | LUXRGB2.3 31.38,38.98 | v21.76,45.79 v19.93,46.48
MISO  (via drill 0.33)
  Top 0.254: v30.53,29.37 29.52,28.36 24.18,28.36 IC3.11 | v38.91,24.04 49.84,13.12 ISP.1
  Bottom 0.254: v30.53,29.37 33.58,29.37 v38.91,24.04
MOSI  (via drill 0.33)
  Top 0.254: v29.52,27.34 24.18,27.34 IC3.10 | v42.47,21.75 49.58,14.64 51.36,14.64 52.38,15.66 ISP.4
  Bottom 0.254: v29.52,27.34 30.53,27.34 36.12,21.75 v42.47,21.75
N$1
  Top 0.254: J1.6 13.77,50.71 13.77,56.04 J1.3
N$2
  Top 0.254: X3.P$1 12.75,33.44 14.02,34.71 15.8,34.71 C7.1 16.05,34.71 16.82,34.71 17.58,33.95 17.58,33.69 19.1,32.17 19.1,30.14 IC3.16
N$3
  Top 0.254: 10.97,35.72 12.5,37.25 X3.P$2 | 10.97,35.72 10.21,34.96 9.2,34.96 C6.1 | 10.97,35.72 10.97,31.66 14.02,28.61 17.83,28.61 18.34,29.12 18.34,29.88 IC3.17
N$4  (via drill 0.33)
  Top 0.254: v42.98,36.49 42.98,33.69 42.47,33.18 41.71,33.18 39.93,31.41 39.93,28.87 T2.1 | v38.66,46.39 38.66,48.93 33.33,54.27 24.44,54.27 22.91,55.79 NKA.7
  Bottom 0.254: v42.98,36.49 42.98,42.07 v38.66,46.39
N$5  (via drill 0.33)
  Top 0.254: v41.71,9.82 37.9,13.63 IC2.1 | v17.83,5.24 17.07,4.48 v13.51,4.48 | v7.42,23.79 6.91,24.29 6.91,28.36 8.43,29.88 CHARGE.C
  Bottom 0.254: v41.71,9.82 41.71,8.29 41.96,8.04 41.96,7.02 40.18,5.24 v17.83,5.24 | v13.51,4.48 13.51,4.99 7.42,11.09 v7.42,23.79
N$6  (via drill 0.33)
  Top 0.254: v37.64,12.36 37.64,11.09 IC2.5 | v31.8,16.93 30.79,16.93 30.53,17.18 RC.2
  Bottom 0.254: v37.64,12.36 36.37,12.36 v31.8,16.93
N$7
  Top 0.254: Q4.3 29.77,20.48 28.75,20.48 27.48,19.21 27.48,13.88 26.72,13.12 U$1.-
N$8  (via drill 0.33)
  Top 0.254: v39.42,36.99 39.42,34.2 36.63,31.41 36.63,25.56 T1.1 | v23.67,50.96 v25.2,50.96
  Bottom 0.254: v39.42,36.99 41.96,39.53 41.96,41.82 32.82,50.96 v25.2,50.96 | v23.67,50.96 23.67,54.01 25.2,55.54 NKA.6
N$9
  Top 0.254: LED1.C 14.78,40.8 14.02,40.04 10.72,40.04 10.21,40.55 Q1.3
N$10  (via drill 0.33)
  Top 0.254: v10.21,25.56 8.69,27.09 8.69,27.85 CHARGE.A | v12.75,18.2 12.75,13.37 RE1.1
  Bottom 0.254: v10.21,25.56 12.75,23.02 v12.75,18.2
N$11  (via drill 0.33)
  Top 0.254: v12.24,40.8 13.26,40.8 LED1.A | v15.55,39.79 16.05,39.79 17.58,38.26 20.88,38.26 v21.39,38.77 | v23.42,41.06 27.48,41.06 v28.18,43.13 | v36.08,40.89 36.63,39.79 37.14,40.3 RE3.1
  Bottom 0.254: v12.24,40.8 14.53,40.8 v15.55,39.79 | v21.39,38.77 23.42,40.8 v23.42,41.06 | v28.18,43.13 33.44,42.25 v36.08,40.89
N$12  (via drill 0.33)
  Top 0.254: v43.74,38.01 43.74,40.3 LED2.C | v37.64,33.95 37.14,33.95 36.63,33.44 Q2.3
  Bottom 0.254: v43.74,38.01 43.74,36.74 44.5,35.98 44.5,34.96 43.49,33.95 v37.64,33.95
N$13  (via drill 0.33)
  Top 0.254: v41.2,41.31 41.96,40.55 LED2.A | v8.69,44.36 8.69,43.6 9.96,42.33 v10.21,42.33 | v18.09,39.03 18.09,40.3 RE4.1
  Bottom 0.254: v41.2,41.31 41.2,41.82 34.34,48.68 15.29,48.68 14.78,49.19 8.69,49.19 7.67,48.17 7.67,45.38 v8.69,44.36 | v10.21,42.33 10.21,41.31 12.5,39.03 v18.09,39.03
N$21  (via drill 0.33)
  Top 0.254: v18.59,10.83 16.56,10.83 RD+1.2 | v22.66,22.01 23.17,22.52 23.93,22.52 IC3.4
  Bottom 0.254: v18.59,10.83 18.59,11.85 22.66,15.91 v22.66,22.01
N$22  (via drill 0.33)
  Top 0.254: v14.53,6.01 13.26,6.01 RD-1.2 | v17.58,9.05 18.59,9.05 v21.9,12.36 | v25.45,17.69 25.45,21.25 24.94,21.75 IC3.3
  Bottom 0.254: v17.58,9.05 v14.53,6.01 | v21.9,12.36 21.9,14.13 v25.45,17.69
N$23  (via drill 0.33)
  Top 0.254: v11.99,42.33 11.74,42.33 11.23,42.84 11.23,43.09 10.47,43.85 U$6.O | v13.51,46.9 12.5,47.92 U$7.I
  Bottom 0.254: v11.99,42.33 11.99,45.38 v13.51,46.9
N$24  (via drill 0.33)
  Top 0.254: v15.8,42.33 15.8,43.85 U$7.O | v16.31,46.39 17.58,47.66 17.58,48.17 U$8.I
  Bottom 0.254: v15.8,42.33 15.8,45.88 v16.31,46.39
N$25  (via drill 0.33)
  Top 0.254: v23.97,48.07 22.32,47.35 20.98,46.16 20.53,45.14 21.13,44.36 U$8.O | v33.71,47.99 36.37,47.66 36.63,47.92 U$9.I
  Bottom 0.254: v33.71,47.99 v23.97,48.07
N$26
  Top 0.254: U$9.O 40.18,44.11 40.18,45.88 41.96,47.66 U$10.I
N$28
  Top 0.254: U$10.O 45.52,43.85 45.52,45.63 47.55,47.66 U$11.I
RESET  (via drill 0.33)
  Top 0.254: R-BTN.B 53.65,40.04 53.65,33.44 R-BTN.B' 53.65,33.18 53.65,19.21 53.9,18.96 53.9,17.94 53.14,17.18 51.11,17.18 50.09,18.2 ISP.5 | v28.25,35.22 28.25,34.71 26.21,32.68 23.42,32.68 21.64,30.9 21.64,30.14 IC3.13
  Bottom 0.254: v28.25,35.22 30.28,35.22 30.79,35.72 34.6,35.72 40.95,29.37 41.45,29.37 49.84,20.99 49.84,18.45 ISP.5
RXD  (via drill 0.33)
  Top 0.254: v16.05,31.41 16.05,30.14 IC3.20 | v19.86,24.04 v17.32,26.58 | v29.52,13.63 29.52,8.8 29.01,8.29 v29.01,6.51
  Bottom 0.254: v16.05,31.41 16.05,27.85 v17.32,26.58 | v19.86,24.04 24.18,24.04 29.52,18.71 v29.52,13.63 | v29.01,6.51 29.52,6.51 30.02,6.01 36.63,6.01 37.9,7.28 JP1.4
SCK  (via drill 0.33)
  Top 0.254: v28.75,26.58 24.18,26.58 IC3.9
  Bottom 0.254: v28.75,26.58 30.53,26.58 41.2,15.91 49.84,15.91 ISP.3
SCL  (via drill 0.33, 0.5 pad 0.25)
  Top 0.254: v18.09,31.66 17.58,31.15 17.58,30.14 IC3.18 | v19.86,33.44 19.86,34.71 RIR3.1 20.12,34.96 22.66,34.96 26.72,39.03 | v24.94,39.53 26.21,39.53 26.72,39.03 | 27.48,38.26 28.75,36.99 IRL.1 | 27.48,38.26 26.72,39.03 | 27.48,38.26 32.73,43.51 | 32.73,43.51 33.33,44.11 33.33,45.38 LUXNIR.CLK | v43.74,35.47 46.28,35.47 EEPRM.6 | v33.4,40.24 34.35,41.51 v35.13,42.2 | v33.22,43.01 32.73,43.51 | v23.15,39.52 v21.65,40.44 | v23.12,46.05 LUXRGB1.2
  Bottom 0.254: v19.86,33.44 v18.09,31.66 | v24.94,39.53 24.94,40.3 LUXNIR1.CLK v23.15,39.52 | v43.74,35.47 35.61,35.47 34.34,36.74 29.01,36.74 IRL.1 | LUXRGB2.2 33.41,40.76 v33.4,40.24 | v35.13,42.2 v33.22,43.01 | v21.65,40.44 24.36,43.95 24.24,44.91 v23.12,46.05
SDA  (via drill 0.33, 0.5 pad 0.25)
  Top 0.254: 40.44,26.83 46.28,32.68 46.28,33.95 EEPRM.5 | 40.44,26.83 36.88,23.28 36.88,22.26 RIR4.1 | 34.6,46.39 34.09,46.9 33.58,46.9 LUXNIR.DATA | 34.6,46.39 34.57,44.65 35.09,43.82 36.03,41.96 34.6,40.55 31.92,37.88 | 31.92,37.88 31.29,37.25 31.29,34.45 IRA.1 | 26.98,46.65 26.21,46.65 LUXRGB1.6 | v16.82,33.44 16.82,30.14 IC3.19 | v22.18,44.06 26.72,44.87 26.98,45.12 26.98,46.65 | 26.98,46.65 v27.23,46.65 | v34.85,46.39 34.6,46.39 | v39.68,27.6 40.44,26.83 | v29.8,41.59 v28.22,40.3 | v30.65,38.75 31.92,37.88
  Bottom 0.254: 27.23,46.39 27.23,45.88 24.94,43.6 24.94,41.82 LUXNIR1.DATA | v16.82,33.44 16.82,34.96 20.12,38.26 20.12,42.58 v22.18,44.06 | 27.23,46.39 v34.85,46.39 | 27.23,46.39 v27.23,46.65 | v39.68,27.6 33.07,34.2 31.29,34.2 IRA.1 | LUXRGB2.6 v29.8,41.59 | v28.22,40.3 29.41,39.19 v30.65,38.75
TXD  (via drill 0.33)
  Top 0.254: v15.29,32.17 15.04,31.91 15.04,30.14 IC3.21 | v19.86,22.77 v16.31,26.33 | v28.25,18.71 28.25,18.45 27.99,18.2 27.99,14.39 28.25,14.13 28.25,11.85 v25.2,8.8 | v22.66,8.8 22.66,7.28 25.45,4.48 37.39,4.48 40.44,7.53 JP1.5
  Bottom 0.254: v15.29,32.17 15.29,27.34 v16.31,26.33 | v19.86,22.77 24.18,22.77 v28.25,18.71 | v22.66,8.8 v25.2,8.8
VBAT  (via drill 0.33)
  Top 0.254: IC2.3 35.87,13.63 35.87,12.61 36.88,11.59 36.88,10.32 38.15,9.05 42.22,9.05 44.76,6.51 47.04,6.51 BAT1.P$2 47.3,6.51 52.88,12.1 53.14,12.1 53.9,12.86 53.9,14.64 v53.65,14.9 | J1.2 11.48,56.04 11.48,50.71 J1.5 11.48,50.46 12.24,50.46 v12.5,50.2 13.51,49.19 13.51,47.92 13.77,47.66 14.02,47.66 14.53,47.15 v14.53,46.9 | v9.45,32.42 8.18,31.15 7.93,31.15 6.4,29.63 6.4,23.02 7.16,22.26 CN1.1 | v28.25,52.23 27.74,52.74 v17.32,52.74
  Bottom 0.254: v14.53,46.9 14.53,42.33 15.29,41.57 16.82,41.57 18.85,39.53 18.85,38.52 12.75,32.42 v9.45,32.42 | v53.65,14.9 53.65,15.15 53.9,15.4 53.9,24.29 45.01,33.18 45.01,41.31 34.09,52.23 v28.25,52.23 | v17.32,52.74 15.04,52.74 v12.5,50.2
VBUS  (via drill 0.33)
  Top 0.254: X2.VBUS 8.69,11.85 9.96,11.85 10.47,11.34 12.75,11.34 RE1.2 13.01,11.34 v14.28,11.34 | 35.1,10.83 33.33,10.83 30.28,7.78 JP1.1 | 35.1,10.83 35.61,10.83 IC2.4 | 35.1,10.83 v35.1,15.15 35.1,16.67 C1.1 | v28.25,24.8 24.18,24.8 IC3.7
  Bottom 0.254: v14.28,11.34 16.82,11.34 20.37,7.78 30.28,7.78 JP1.1 | v28.25,24.8 31.55,24.8 38.15,18.2 | 38.15,18.2 41.71,14.64 51.11,14.64 52.38,13.37 ISP.2 | 38.15,18.2 v35.1,15.15
VCC  (via drill 0.33, 0.5 pad 0.25)
  Top 0.254: v19.61,11.34 19.36,11.59 18.34,11.59 18.09,11.85 18.09,13.12 14.28,16.93 14.28,18.2 IC3.34 | 19.36,27.85 20.63,29.12 20.63,29.88 IC3.14 20.88,30.14 v20.88,31.41 | 19.36,27.85 18.85,27.34 12.75,27.34 IC3.24 | 22.91,24.29 23.93,24.29 IC3.6 | 19.36,27.85 22.91,24.29 | 21.64,10.83 24.44,13.63 24.44,15.4 C3.1 24.44,15.66 23.17,16.93 22.4,16.93 | 21.64,10.83 18.59,7.78 16.56,7.78 RU1.2 | 22.4,16.93 21.39,16.93 20.88,17.44 20.88,18.2 IC3.42 20.88,18.45 20.88,19.47 21.13,19.72 21.13,22.52 22.91,24.29 | 22.4,16.93 22.4,18.2 IC3.44 | 21.64,10.83 21.9,10.83 26.47,6.26 U$1.+ 26.72,6.01 26.98,5.75 30.53,5.75 32.06,7.28 32.82,7.28 JP1.2 | 30.02,47.41 31.29,47.41 31.8,46.9 LUXNIR.VDD 31.8,46.65 31.8,46.14 LUXNIR.ADR | 30.02,47.41 30.1,47.97 | 30.1,47.97 25.27,47.97 24.18,46.65 LUXRGB1.1 | 30.02,47.41 v26.72,44.11 | 30.1,47.97 29.77,49.95 C14.1 | C4.1 46.53,52.49 50.6,52.49 51.11,51.98 THM1.2 | 47.3,42.33 47.3,38.77 46.53,38.01 EEPRM.8 46.53,37.76 | 47.3,42.33 47.3,43.6 U$11.D 47.55,43.85 v48.82,45.12 | 40.69,42.33 41.96,43.6 U$10.D | 40.69,42.33 39.68,41.31 | 39.68,41.31 39.42,41.06 39.42,40.55 RE3.2 39.17,40.3 37.9,39.03 34.09,39.03 | 39.68,41.31 39.42,41.31 36.88,43.85 U$9.D 36.63,44.11 35.87,44.87 v35.36,44.87 | 40.69,42.33 47.3,42.33 | U$6.D 7.16,44.11 8.69,45.63 11.23,45.63 12.24,44.61 12.24,44.11 U$7.D 12.5,44.11 13.51,44.11 15.04,45.63 16.31,45.63 17.58,44.36 U$8.D 17.83,44.11 17.83,43.09 20.63,40.3 | 20.88,36.99 22.15,38.26 22.15,39.28 21.13,40.3 20.63,40.3 | 20.88,36.99 20.63,36.74 20.12,36.74 RIR3.2 | 20.63,40.3 20.12,40.3 RE4.2 20.63,40.3 | 33.83,27.34 33.58,27.34 31.8,25.56 IC4.2
  Top 0.254: 33.83,27.34 35.61,27.34 T1.2 35.87,27.34 35.87,23.28 | 35.87,23.28 34.85,22.26 RIR4.2 | 35.87,23.28 38.66,26.07 38.66,30.64 T2.2 | 33.83,27.34 32.56,28.61 | 32.56,28.61 29.52,31.66 28.75,31.66 IRP.1 | v22.15,35.72 20.88,36.99 | 34.09,39.03 32.56,37.5 32.56,28.61 | 34.09,39.03 34.72,39.54 v35.51,40.09
  Bottom 0.254: v19.61,11.34 29.01,11.34 32.82,7.53 JP1.2 | LUXNIR1.VDD 26.72,41.82 v26.72,44.11 34.6,44.11 v35.36,44.87 | v48.82,45.12 51.11,47.41 51.11,51.73 THM1.2 | 23.67,34.2 25.96,31.91 28.5,31.91 IRP.1 | 23.67,34.2 v22.15,35.72 | 23.67,34.2 v20.88,31.41 | LUXRGB2.1 33.8,41.32 v35.51,40.09
VDD  (via drill 0.33)
  Top 0.254: J1.1 8.69,56.04 8.69,50.71 J1.4 8.94,50.46 8.94,48.42 9.2,48.17 v9.2,46.39 | 33.33,22.26 33.83,21.75 33.83,21.25 34.09,20.99 35.61,20.99 36.37,20.23 36.37,19.72 C2.1 | 33.33,22.26 31.55,24.04 31.29,24.04 30.79,24.55 30.79,27.34 IC4.3 | v10.47,36.49 10.47,36.23 10.21,35.98 v7.93,35.98 | v23.42,14.39 v21.64,16.17 | 33.33,22.26 v28.75,17.69
  Bottom 0.254: v9.2,46.39 9.2,45.12 9.45,44.87 9.45,37.5 v10.47,36.49 | v7.93,35.98 7.93,29.12 14.78,22.26 14.78,21.25 19.86,16.17 v21.64,16.17 | v23.42,14.39 25.45,14.39 v28.75,17.69

### Text on the board
tPlace: off | **OPEN-LUX** | Btn3 | http://publiclab.org/wiki/open-lux | REV-G | on | RGB | Btn2 | LUX | + | C5 | VCC | - | Btn1 | JST | USB | VCC | SCL | A0 | GND | RX | TX | SDA | VBUS
bPlace: publiclab.org/wiki/open-lux | NOKIA 5110 | GND | LED | VCC | D6 | D7 | D8 | GND | D9 | LUX | RGB | VBUS | MISO | MOSI | SCK | GND | RST